# Altium schematic sheet MICROSD CARD.SchDoc
size A4; SheetNumber: 4; SheetTotal: 9
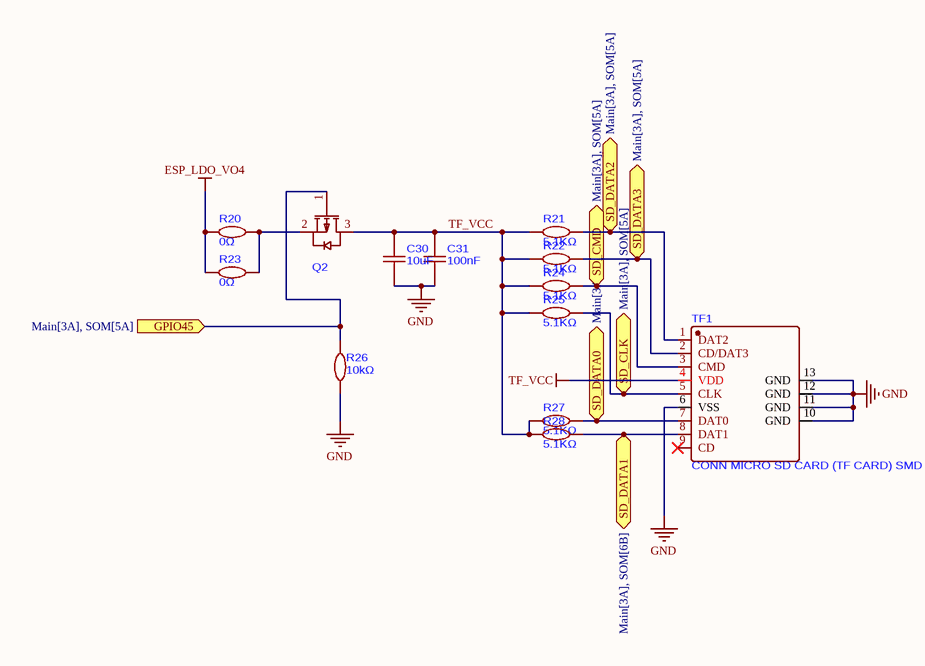
[diagram p0: MICROSD CARD.SchDoc]

## Parts
C30  10uF  [C0603]
C31  100nF  [C0603]
Q2  MOSFET P-CH 30V 4.3A SOT-23  [SOT-23-3_L2.9-W1.6-P1.90-LS2.8-BR]  (value not drawn)
R20  0Ω  [R0603]
R21  5.1KΩ  [R0603]
R22  5.1KΩ  [R0603]
R23  0Ω  [R0603]
R24  5.1KΩ  [R0603]
R25  5.1KΩ  [R0603]
R26  10kΩ  [R0603]
R27  5.1KΩ  [R0603]
R28  5.1KΩ  [R0603]
TF1  CONN MICRO SD CARD (TF CARD) SMD  [TF-SMD_SH_SH-TF-01B]

## Ports
GPIO45 (in, see Main[3A], SOM[5A]), SD_CLK (bidir, see Main[3A], SOM[5A]), SD_CMD (bidir, see Main[3A], SOM[5A]), SD_DATA0 (bidir, see Main[3A], SOM[6B]), SD_DATA1 (bidir, see Main[3A], SOM[6B]), SD_DATA2 (bidir, see Main[3A], SOM[5A]), SD_DATA3 (bidir, see Main[3A], SOM[5A])

## Nets
ESP_LDO_VO4: R20.1 R23.1
GND: C30.1 C31.1 R26.1 TF1.6(VSS) TF1.10(GND) TF1.11(GND) TF1.12(GND) TF1.13(GND)
TF_VCC: C30.2 C31.2 Q2.3(D) R21.1 R22.1 R24.1 R25.1 R27.1 R28.1 TF1.4(VDD)
GPIO45: Q2.1(G) R26.2 ; port GPIO45
SD_CLK: R25.2 TF1.5(CLK) ; port SD_CLK
SD_CMD: R24.2 TF1.3(CMD) ; port SD_CMD
SD_DATA0: R27.2 TF1.7(DAT0) ; port SD_DATA0
SD_DATA1: R28.2 TF1.8(DAT1) ; port SD_DATA1
SD_DATA2: R21.2 TF1.1(DAT2) ; port SD_DATA2
SD_DATA3: R22.2 TF1.2(CD/DAT3) ; port SD_DATA3
NetQ2_2: Q2.2(S) R20.2 R23.2

Not connected (* = marked no-connect by the designer): TF1 9(CD)*

## Library data of the parts
C30 = CL10A106MA8NRNC: 25V 10uF X5R ±20% 0603 Ceramic Capacitors ROHS
C31 = CC0603KRX7R9BB104: 50V 100nF X7R ±10% 0603 Ceramic Capacitors ROHS
Q2 = AO3407A: 30V 4.3A 48mΩ@10V 2.5V@250uA 1 P-Channel SOT-23 Single FETs, MOSFETs ROHS
R20 R23 = RC0603JR-070RL: 100mW 0Ω 75V Thick Film Resistor ±5% 0603 Chip Resistor - Surface Mount RoHS
R21 R22 R24 R25 R27 R28 = FRC0603F5101TS: 100mW 5.1kΩ 75V ±100ppm/℃ Thick Film Resistor ±1% 0603 Chip Resistor - Surface Mount RoHS
R26 = RC0603FR-0710KL: 100mW 10kΩ 75V ±100ppm/℃ Thick Film Resistor ±1% 0603 Chip Resistor - Surface Mount ROHS
TF1 = SH-TF-01A: -25℃~+85℃ Push-Push 2mm Connector and Ejector MicroSD Card (TF Card) SMD PC Card Sockets RoHS